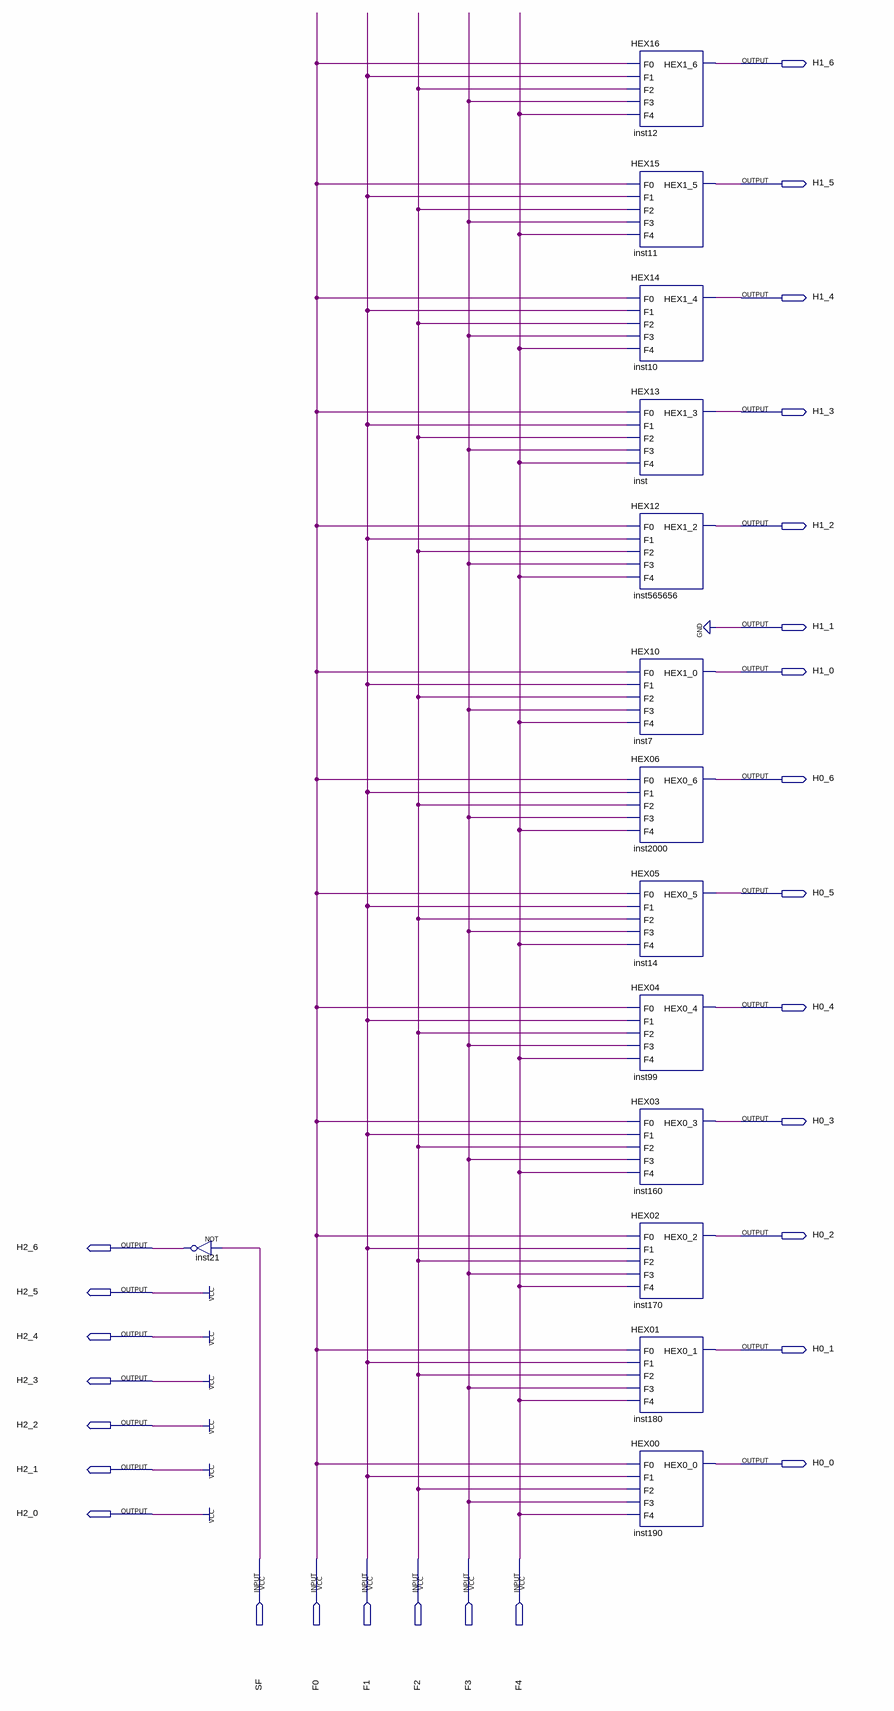
[diagram p0: schematic sheet]
// Quartus schematic decodificador_7_segmentos.bdf as structural Verilog: 14 symbols, 27 pins
module decodificador_7_segmentos (
  input  SF,
  input  F0,
  input  F1,
  input  F2,
  input  F3,
  input  F4,
  output H1_6,
  output H1_5,
  output H1_4,
  output H1_3,
  output H1_2,
  output H1_1,
  output H1_0,
  output H0_6,
  output H0_5,
  output H0_4,
  output H0_3,
  output H0_2,
  output H2_6,
  output H2_5,
  output H2_4,
  output H0_1,
  output H2_3,
  output H2_2,
  output H0_0,
  output H2_1,
  output H2_0
);

  not inst21 (H2_6, SF);
  HEX16 inst12 (.F0(F0), .F1(F1), .F2(F2), .F3(F3), .F4(F4), .HEX1_6(H1_6));
  HEX15 inst11 (.F0(F0), .F1(F1), .F2(F2), .F3(F3), .F4(F4), .HEX1_5(H1_5));
  HEX14 inst10 (.F0(F0), .F1(F1), .F2(F2), .F3(F3), .F4(F4), .HEX1_4(H1_4));
  HEX13 inst (.F0(F0), .F1(F1), .F2(F2), .F3(F3), .F4(F4), .HEX1_3(H1_3));
  HEX12 inst565656 (.F0(F0), .F1(F1), .F2(F2), .F3(F3), .F4(F4), .HEX1_2(H1_2));
  HEX10 inst7 (.F0(F0), .F1(F1), .F2(F2), .F3(F3), .F4(F4), .HEX1_0(H1_0));
  HEX06 inst2000 (.F0(F0), .F1(F1), .F2(F2), .F3(F3), .F4(F4), .HEX0_6(H0_6));
  HEX05 inst14 (.F0(F0), .F1(F1), .F2(F2), .F3(F3), .F4(F4), .HEX0_5(H0_5));
  HEX04 inst99 (.F0(F0), .F1(F1), .F2(F2), .F3(F3), .F4(F4), .HEX0_4(H0_4));
  HEX03 inst160 (.F0(F0), .F1(F1), .F2(F2), .F3(F3), .F4(F4), .HEX0_3(H0_3));
  HEX02 inst170 (.F0(F0), .F1(F1), .F2(F2), .F3(F3), .F4(F4), .HEX0_2(H0_2));
  HEX01 inst180 (.F0(F0), .F1(F1), .F2(F2), .F3(F3), .F4(F4), .HEX0_1(H0_1));
  HEX00 inst190 (.F0(F0), .F1(F1), .F2(F2), .F3(F3), .F4(F4), .HEX0_0(H0_0));

  assign H1_1 = 1'b0;
  assign H2_0 = 1'b1;
  assign H2_1 = 1'b1;
  assign H2_2 = 1'b1;
  assign H2_3 = 1'b1;
  assign H2_4 = 1'b1;
  assign H2_5 = 1'b1;
endmodule
